# Altium schematic sheet MSXII_SteeringWheelBoard.SchDoc: Steering Wheel Right Board
size Letter; Organization: Midnight Sun Solar Rayce Car Team; Address1: University of Waterloo; Address2: 200 University Ave W; Address3: Waterloo, ON, Canada; Address4: N2L 3E9; Revision: 1.17; SheetNumber: 1; SheetTotal: 2; Website: www.uwmidsun.com
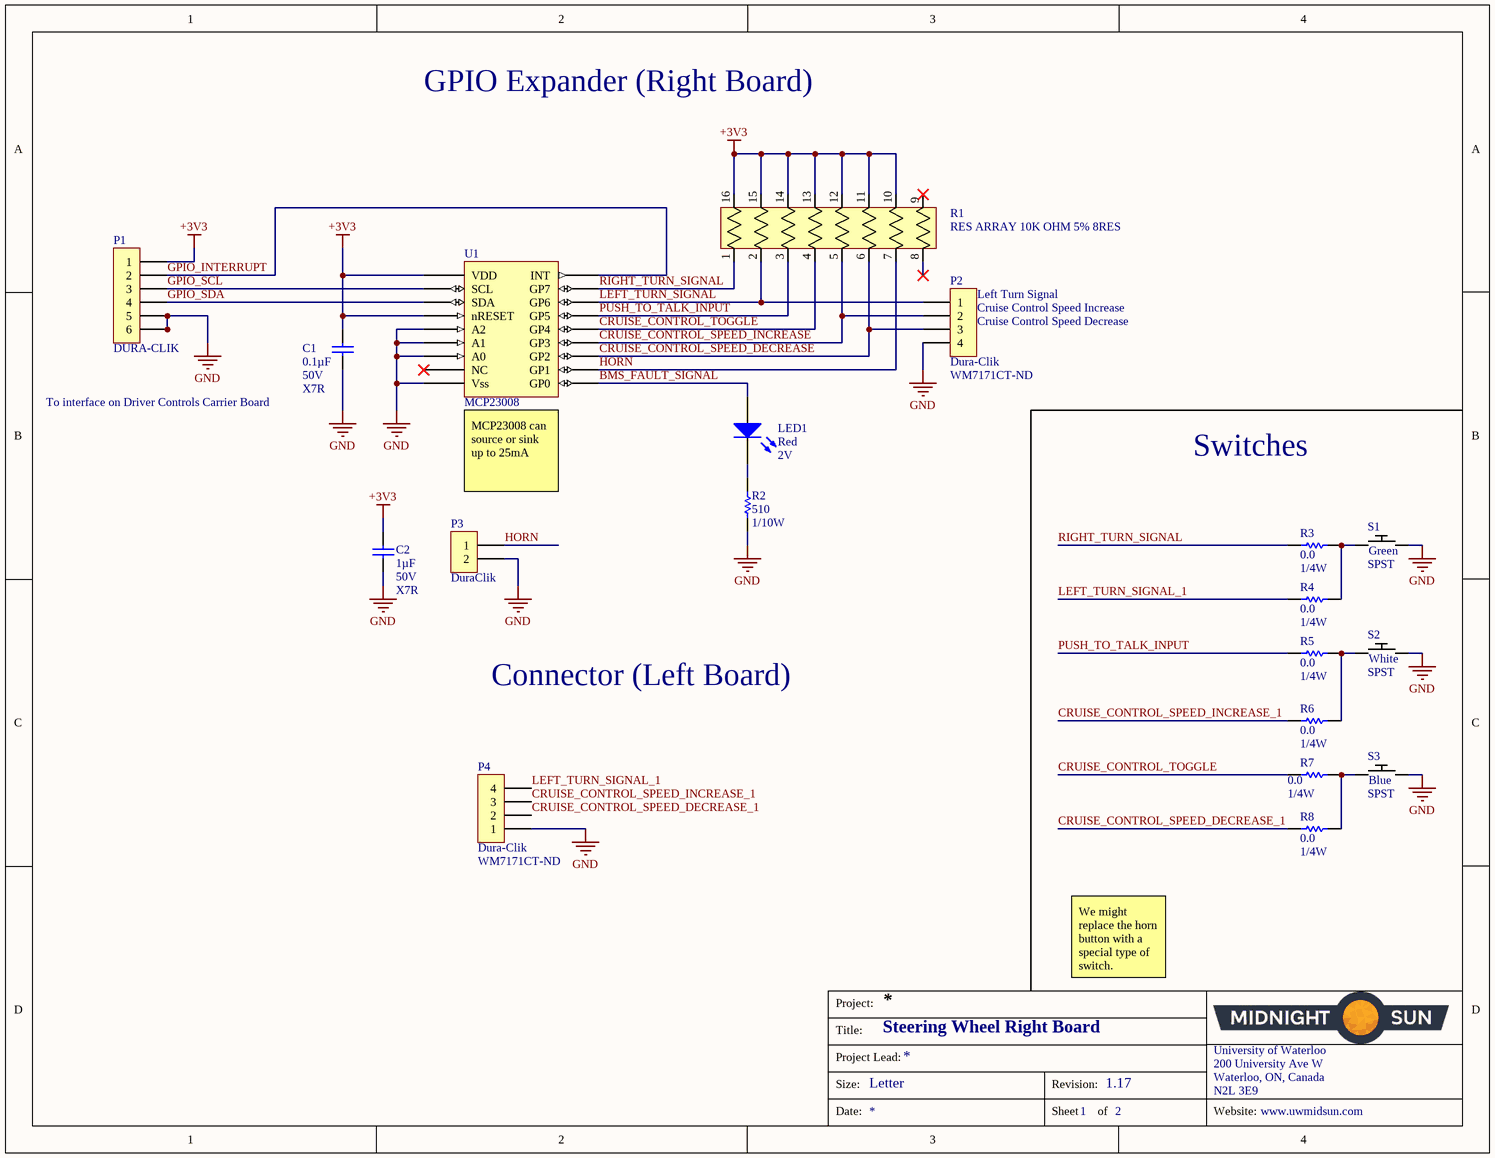
[diagram p0: MSXII_SteeringWheelBoard.SchDoc]

## Parts
C1  Capacitance: 0.1µF  Voltage: 50V  Temperature Coefficient: X7R  [CAP, 0603]  (hidden comment: CAP CER 0.1UF 50V 10% X7R 0603)
C2  Capacitance: 1µF  Voltage: 50V  Temperature Coefficient: X7R  [CAP, 0603]  (hidden comment: CAP CER 1UF 50V 10% X7R 0603)
LED1  Color: Red  Voltage - Forward (Vf) (Typ): 2V  [LED_0603]  (hidden comment: LED RED CLEAR 2V 0603)
P1  DURA-CLIK  [CONN, 6POS Dura-Click]
P2  Dura-Clik  Supplier Part Number 1: WM7171CT-ND  [CONN, 4POS Dura-Click]
P3  Series: DuraClik  [CONN, 2POS Dura-Click]  (hidden comment: CONN 2POS DURA-CLIK 0.079")
P4  Dura-Clik  Supplier Part Number 1: WM7171CT-ND  [CONN, 4POS Dura-Click]
R1  RES ARRAY 10K OHM 5% 8RES  [RES ARRAY, 8 POS 1506]
R2  Resistance: 510  Power: 1/10W  [RES, 0603]  (hidden comment: RES 510 OHM 5% 1/10W 0603)
R3  Resistance: 0.0  Power (Watts): 1/4W  [RES, 0603]  (hidden comment: RES 0.0 OHM 1/4W 0603)
R4  Resistance: 0.0  Power (Watts): 1/4W  [RES, 0603]  (hidden comment: RES 0.0 OHM 1/4W 0603)
R5  Resistance: 0.0  Power (Watts): 1/4W  [RES, 0603]  (hidden comment: RES 0.0 OHM 1/4W 0603)
R6  Resistance: 0.0  Power (Watts): 1/4W  [RES, 0603]  (hidden comment: RES 0.0 OHM 1/4W 0603)
R7  Resistance: 0.0  Power (Watts): 1/4W  [RES, 0603]  (hidden comment: RES 0.0 OHM 1/4W 0603)
R8  Resistance: 0.0  Power (Watts): 1/4W  [RES, 0603]  (hidden comment: RES 0.0 OHM 1/4W 0603)
S1  SPST  [SW SPST D6 SERIES GREEN]
S2  SPST  [SW SPST D6 SERIES WHITE]
S3  SPST  [SW SPST D6 SERIES BLUE]
U1  MCP23008  [IC 18SOIC]

## Nets
+3V3: C1.1 C2.1 P1.1 R1.10 R1.11 R1.12 R1.13 R1.14 R1.15 R1.16 U1.6(nRESET) U1.18(VDD)
GND: C1.2 C2.2 P1.5 P1.6 P2.4 P3.2 P4.1 R2.2 S1.2 S2.2 S3.2 U1.3(A2) U1.4(A1) U1.5(A0) U1.9(Vss)
BMS_FAULT_SIGNAL: LED1.1(A) U1.10(GP0)
CRUISE_CONTROL_SPEED_DECREASE: P2.3 R1.6 U1.12(GP2)
CRUISE_CONTROL_SPEED_DECREASE_1: P4.2 R8.1
CRUISE_CONTROL_SPEED_INCREASE: P2.2 R1.5 U1.13(GP3)
CRUISE_CONTROL_SPEED_INCREASE_1: P4.3 R6.1
CRUISE_CONTROL_TOGGLE: R1.4 R7.1 U1.14(GP4)
GPIO_INTERRUPT: P1.2 U1.8(INT)
GPIO_SCL: P1.3 U1.1(SCL)
GPIO_SDA: P1.4 U1.2(SDA)
HORN: P3.1 R1.7 U1.11(GP1)
LEFT_TURN_SIGNAL: P2.1 R1.2 U1.16(GP6)
LEFT_TURN_SIGNAL_1: P4.4 R4.1
PUSH_TO_TALK_INPUT: R1.3 R5.1 U1.15(GP5)
RIGHT_TURN_SIGNAL: R1.1 R3.1 U1.17(GP7)
NetLED1_2: LED1.2(K) R2.1
NetR3_2: R3.2 R4.2 S1.1
NetR5_2: R5.2 R6.2 S2.1
NetR7_2: R7.2 R8.2 S3.1

Not connected (* = marked no-connect by the designer): R1 8* 9*; U1 7(NC)*

## Notes on the sheet
- GPIO Expander (Right Board)
- (near P2) Left Turn Signal
- (near P2) Cruise Control Speed Increase
- (near P2) Cruise Control Speed Decrease
- To interface on Driver Controls Carrier Board
- (near U1) MCP23008 can source or sink up to 25mA
- Switches
- Connector (Left Board)
- We might replace the horn button with a special type of switch.
- Project:
- Title:
- Size:
- Project Lead:
- Letter
- Revision:
- University of Waterloo
- 200 University Ave W
- Waterloo, ON, Canada
- N2L 3E9
- Date:
- Sheet
- of
- Website:

## Library data of the parts
C1 = CAP CER 0.1UF 50V 10% X7R 0603: 0.10µF ±10% 50V Ceramic Capacitor X7R 0603 (1608 Metric); Manufacturer 1: AVX Corporation; Manufacturer Part Number 1: 06035C104KAT2A; Supplier 1: Digi-Key; Supplier Part Number 1: 478-5052-1-ND; Packaging: Cut Tape (CT); Part Status: Active; Operating Temperature: -55°C ~ 125°C; Ratings: -; Mounting Type: Surface Mount, MLCC; Package / Case: 0603 (1608 Metric); Size / Dimension: 0.063" L x 0.032" W (1.60mm x 0.81mm); Height - Seated (Max): -; Thickness (Max): 0.035" (0.90mm); Lead Spacing: -; Lead Style: -; ComponentLink1URL: http://datasheets.avx.com/X7RDielectric.pdf; ComponentLink1Description: http://datasheets.avx.com/X7RDielectric.pdf; Tolerance: ±10%
C2 = CAP CER 1UF 50V 10% X7R 0603: 1µF ±10% 50V Ceramic Capacitor X7R 0603 (1608 Metric); Manufacturer 1: Taiyo Yuden; Manufacturer Part Number 1: UMK107AB7105KA-T; Supplier 1: Digi-Key; Supplier Part Number 1: 587-3247-1-ND; Packaging: Cut Tape (CT); Part Status: Active; Operating Temperature: -55°C ~ 125°C; Ratings: -; Mounting Type: Surface Mount, MLCC; Package / Case: 0603 (1608 Metric); Size / Dimension: 0.063" L x 0.031" W (1.60mm x 0.80mm); Height - Seated (Max): -; Thickness (Max): 0.037" (0.95mm); Lead Spacing: -; Lead Style: -; ComponentLink1URL: http://www.yuden.co.jp/productdata/catalog/en/mlcc_all_e.pdf; ComponentLink1Description: http://www.yuden.co.jp/productdata/catalog/en/mlcc_all_e.pdf; Tolerance: ±10%
LED1 = LED RED CLEAR 2V 0603: Red 631nm LED Indication - Discrete 2V 0603 (1608 Metric); Manufacturer: Wurth Electronics Inc.; Manufacturer Part Number: 150060RS75000; Lens Color: Colorless; Millicandela Rating: 250mcd; Lens Style/Size: Rectangle with Flat Top, 1.10mm x 0.70mm; Current - Test: 20mA; Viewing Angle: 140°; Wavelength - Dominant: 625nm; Wavelength - Peak: 630nm; Supplier 1: Digi-Key; RoHS: RoHS Compliant; Category: Optoelectronics; Stock 1: 35521; Pricing 1: 1=0.21, 100=0.1617, 500=0.13964 (CAD); Packaging: Cut Tape (CT); Part Status: Active; Lens Transparency: Clear; Mounting Type: Surface Mount; Features: -; Package / Case: 0603 (1608 Metric); Supplier Device Package: 0603; Size / Dimension: 1.60mm L x 0.80mm W; Height (Max): 0.80mm; ComponentLink1URL: http://katalog.we-online.de/led/datasheet/150060RS75000.pdf; ComponentLink1Description: http://katalog.we-online.de/led/datasheet/150060RS75000.pdf; Supplier Part Number 1: 732-4978-1-ND
P1 = CONN 6POS DURA-CLIK 0.079" RGT: 6 Positions Header, Shrouded Connector 0.079" (2.00mm) Surface Mount, Right Angle Tin; Manufacturer: Molex, LLC; Manufacturer Part Number: 5023520600; Style: Board to Cable/Wire; Shrouding: Shrouded - 4 Wall; Number of Positions: 6; Number of Positions Loaded: All; Contact Length - Mating: 0.135" (3.45mm); Material Flammability Rating: UL94 V-0; Mated Stacking Heights: 11mm; Supplier 1: Digi-Key; RoHS: RoHS Compliant; Category: Connectors, Interconnects; Stock 1: 3108; Pricing 1: 1=2.31, 10=2.091, 25=1.964, 50=1.8784, 100=1.7929, 250=1.6222 (CAD); Packaging: Cut Tape (CT); Part Status: Active; Connector Type: Header; Contact Type: Male Pin; Pitch - Mating: 0.079" (2.00mm); Number of Rows: 1; Row Spacing - Mating: -; Mounting Type: Surface Mount, Right Angle; Termination: Solder; Fastening Type: Latch Lock; Contact Length - Post: -; Overall Contact Length: -; Insulation Height: 0.252" (6.40mm); Contact Shape: Square; Contact Finish - Mating: Tin; Contact Finish Thickness - Mating: -; Contact Finish - Post: Tin; Contact Material: Copper Alloy; Insulation Material: Polyamide (PA), Nylon; Features: Solder Retention; Operating Temperature: -; Ingress Protection: -; Insulation Color: Natural; Current Rating: -; Voltage Rating: -; Contact Finish Thickness - Post: -; Applications: Automotive, Industrial; ComponentLink1URL: http://www.molex.com/pdm_docs/sd/5023520200_sd.pdf; ComponentLink1Description: http://www.molex.com/pdm_docs/sd/5023520200_sd.pdf; Supplier Part Number 1: WM7173CT-ND
P2 P4 = CONN 4POS DURA-CLIK 0.079" RGT: 4 Positions Header Connector 0.079" (2.00mm) Surface Mount, Right Angle Tin; Manufacturer: Molex, LLC; Manufacturer Part Number: 5023520400; Style: Board to Cable/Wire; Shrouding: Shrouded - 4 Wall; Number of Positions: 4; Number of Positions Loaded: All; Contact Length - Mating: 0.135" (3.45mm); Material Flammability Rating: UL94 V-0; Mated Stacking Heights: 11mm; Supplier 1: Digi-Key; RoHS: RoHS Compliant; Category: Connectors, Interconnects; Stock 1: 10075; Pricing 1: 1=2.07, 10=1.823, 25=1.7164, 50=1.6446, 100=1.5731, 250=1.43016 (CAD); Packaging: Cut Tape (CT); Part Status: Active; Connector Type: Header; Contact Type: Male Pin; Pitch - Mating: 0.079" (2.00mm); Number of Rows: 1; Row Spacing - Mating: -; Mounting Type: Surface Mount, Right Angle; Termination: Solder; Fastening Type: Latch Lock; Contact Length - Post: -; Overall Contact Length: -; Insulation Height: 0.252" (6.40mm); Contact Shape: Square; Contact Finish - Mating: Tin; Contact Finish Thickness - Mating: -; Contact Finish - Post: Tin; Contact Material: Copper Alloy; Insulation Material: Polyamide (PA), Nylon; Features: Solder Retention; Operating Temperature: -; Ingress Protection: -; Insulation Color: Natural; Current Rating: -; Voltage Rating: -; Contact Finish Thickness - Post: -; Applications: Automotive, Industrial; ComponentLink1URL: http://www.molex.com/pdm_docs/sd/5023520200_sd.pdf; ComponentLink1Description: http://www.molex.com/pdm_docs/sd/5023520200_sd.pdf
P3 = CONN 2POS DURA-CLIK 0.079": 2 Positions Header, Shrouded Connector 0.079" (2.00mm) Surface Mount, Right Angle Tin; Manufacturer 1: Molex, LLC; Manufacturer Part Number 1: 5023520200; Style: Board to Cable/Wire; Shrouding: Shrouded - 4 Wall; Number of Positions: 2; Number of Positions Loaded: All; Contact Length - Mating: 0.135" (3.45mm); Material Flammability Rating: UL94 V-0; Mated Stacking Heights: 11mm; Supplier 1: Digi-Key; Supplier Part Number 1: WM7169CT-ND; Packaging: Cut Tape (CT); Part Status: Active; Connector Type: Header; Contact Type: Male Pin; Number of Rows: 1; Row Spacing - Mating: -; Mounting Type: Surface Mount, Right Angle; Termination: Solder; Fastening Type: Latch Lock; Contact Length - Post: -; Overall Contact Length: -; Insulation Height: 0.252" (6.40mm); Contact Shape: Square; Contact Finish - Mating: Tin; Contact Finish Thickness - Mating: -; Contact Finish - Post: Tin; Contact Material: Copper Alloy; Insulation Material: Polyamide (PA), Nylon; Operating Temperature: -; Ingress Protection: -; Insulation Color: Natural; Current Rating: -; Contact Finish Thickness - Post: -; ComponentLink1URL: http://www.molex.com/pdm_docs/sd/5023520200_sd.pdf; ComponentLink1Description: http://www.molex.com/pdm_docs/sd/5023520200_sd.pdf; Voltage: -; Pitch - Mating: 0.079" (2.00mm)
R1 = RES ARRAY 10K OHM 5% 8RES EXB-2HV103JV: RES ARRAY SMD 10K 5% 62.5mW 1506; Manufacturer: Panasonic Electronic Components; Vendor: Panasonic; C: Copyright (C) 2015 Accelerated Designs. All rights reserved; Circuit Type: Isolated; Temperature Coefficient: ±200ppm/°C; Value: Value; Copyright: Copyright (C) 2015 Accelerated Designs. All rights reserved; Manufacturer_Part_Number: EXB-2HV103JV; Supplier 1: Digi-Key; Supplier Part Number 1: Y1103CT-ND; Manufacturer Part Number: EXB-2HV103JV; RoHS: RoHS Compliant; Category: Resistors; Stock 1: 152779; Pricing 1: 1=0.43, 10=0.373, 25=0.2712, 50=0.1964, 100=0.1456, 250=0.11176, 500=0.08806, 1000=0.06096 (CAD); Packaging: Cut Tape (CT); Part Status: Active; Resistance (Ohms): 10k; Tolerance: ±5%; Power Per Element: 62.5mW; Operating Temperature: -55°C ~ 125°C; Applications: Automotive AEC-Q200; Mounting Type: Surface Mount; Package / Case: 1506, Convex, Long Side Terminals; Supplier Device Package: 1506; Size / Dimension: 0.150" L x 0.063" W (3.80mm x 1.60mm); Height - Seated (Max): 0.022" (0.55mm); ComponentLink1URL: https://industrial.panasonic.com/cdbs/www-data/pdf/AOC0000/AOC0000C14.pdf; ComponentLink1Description: https://industrial.panasonic.com/cdbs/www-data/pdf/AOC0000/AOC0000C14.pdf
R2 = RES 510 OHM 5% 1/10W 0603: RES SMD 510 OHM 5% 1/10W 0603; Manufacturer 1: Yageo; Manufacturer Part Number 1: RC0603JR-07510RL; Temperature Coefficient: ±100ppm/°C; Supplier 1: Digi-Key; Supplier Part Number 1: 311-510GRCT-ND; Packaging: Cut Tape (CT); Part Status: Active; Composition: Thick Film; Operating Temperature: -55°C ~ 155°C; Package / Case: 0603 (1608 Metric); Supplier Device Package: 0603; Size / Dimension: 0.063" L x 0.031" W (1.60mm x 0.80mm); Height - Seated (Max): 0.022" (0.55mm); Failure Rate: -; ComponentLink1URL: http://www.yageo.com/documents/recent/PYu-RC_Group_51_RoHS_L_7.pdf; ComponentLink1Description: http://www.yageo.com/documents/recent/PYu-RC_Group_51_RoHS_L_7.pdf; Tolerance: ±5%
R3-R8 = RES 0.0 OHM 1/4W 0603: RES SMD 0.0 OHM JUMPER 1/4W 0603; Manufacturer 1: Vishay Dale; Manufacturer Part Number 1: CRCW06030000Z0EAHP; Supplier 1: Digi-Key; Supplier Part Number 1: 541-0.0SBCT-ND; Packaging: Cut Tape (CT); Part Status: Active; Composition: Thick Film; Operating Temperature: -55°C ~ 155°C; Package / Case: 0603 (1608 Metric); Supplier Device Package: 0603; Size / Dimension: 0.063" L x 0.033" W (1.60mm x 0.85mm); Height - Seated (Max): 0.022" (0.55mm); Failure Rate: -; ComponentLink1URL: http://www.vishay.com/docs/20043/crcwhpe3.pdf; ComponentLink1Description: http://www.vishay.com/docs/20043/crcwhpe3.pdf
S1 = SW SPST-NO 0.1A 32V D6 Series Green: Pushbutton Switch SPST-NO Keyswitch Through Hole D6 Series Green; Manufacturer: C&K; Manufacturer Part Number: D6R50 F1 LFS; Switch Function: Off-Mom; Current Rating: 100mA (DC); Voltage Rating - DC: 32V; Actuator Type: Round, Button; Electrical Life: 250,000 Cycles; Supplier 1: Digi-Key; RoHS: RoHS Compliant; Category: Switches; Stock 1: 3742; Pricing 1: 1=1.73, 10=1.607, 25=1.5308, 50=1.454, 100=1.4158, 250=1.37756, 500=1.30102, 1000=1.22448, 5000=1.03316 (CAD); Packaging: Bulk; Part Status: Active; Type: Keyswitch; Circuit: SPST-NO; Voltage Rating - AC: -; Color - Actuator/Cap: Green; Illumination Type, Color: -; Illumination Voltage (Nominal): -; Mounting Type: Through Hole; Termination Style: PC Pin; Ingress Protection: -; Features: Tactile Feedback; Panel Cutout Dimensions: -; Operating Temperature: -20°C ~ 85°C; Mechanical Life: -; ComponentLink1URL: http://www.ckswitches.com/media/1341/d6.pdf; ComponentLink1Description: http://www.ckswitches.com/media/1341/d6.pdf; Supplier Part Number 1: 401-1976-ND
S2 = SW SPST-NO 0.1A 32V D6 Series White: Pushbutton Switch SPST-NO Keyswitch Through Hole D6 Series White; Manufacturer: C&K; Manufacturer Part Number: D6R00 F2 LFS; Switch Function: Off-Mom; Current Rating: 100mA (DC); Voltage Rating - DC: 32V; Actuator Type: Round, Button; Electrical Life: 250,000 Cycles; Supplier 1: Digi-Key; RoHS: RoHS Compliant; Category: Switches; Stock 1: 6244; Pricing 1: 1=1.64, 10=1.532, 25=1.4584, 50=1.3856, 100=1.3492, 250=1.31272, 500=1.2398, 1000=1.16686, 5000=0.98454 (CAD); Packaging: Bulk; Part Status: Active; Type: Keyswitch; Circuit: SPST-NO; Voltage Rating - AC: -; Color - Actuator/Cap: White; Illumination Type, Color: -; Illumination Voltage (Nominal): -; Mounting Type: Through Hole; Termination Style: PC Pin; Ingress Protection: -; Features: Tactile Feedback; Panel Cutout Dimensions: -; Operating Temperature: -20°C ~ 85°C; Mechanical Life: -; ComponentLink1URL: http://www.ckswitches.com/media/1341/d6.pdf; ComponentLink1Description: http://www.ckswitches.com/media/1341/d6.pdf; Supplier Part Number 1: 401-1989-ND; Supplier 2: Digi-Key; Stock 2: 3742; Pricing 2: 1=1.73, 10=1.607, 25=1.5308, 50=1.454, 100=1.4158, 250=1.37756, 500=1.30102, 1000=1.22448, 5000=1.03316 (CAD); Supplier Part Number 2: 401-1976-ND
S3 = SW SPST-NO 0.1A 32V D6 Series Blue: Pushbutton Switch SPST-NO Keyswitch Through Hole D6 Series Blue; Manufacturer: C&K; Manufacturer Part Number: D6R60 F1 LFS; Switch Function: Off-Mom; Current Rating: 100mA (DC); Voltage Rating - DC: 32V; Actuator Type: Round, Button; Electrical Life: 250,000 Cycles; Supplier 1: Digi-Key; RoHS: RoHS Compliant; Category: Switches; Stock 1: 3385; Pricing 1: 1=1.73, 10=1.607, 25=1.5308, 50=1.454, 100=1.4158, 250=1.37756, 500=1.30102, 1000=1.22448, 5000=1.03316 (CAD); Packaging: Bulk; Part Status: Active; Type: Keyswitch; Circuit: SPST-NO; Voltage Rating - AC: -; Color - Actuator/Cap: Blue; Illumination Type, Color: -; Illumination Voltage (Nominal): -; Mounting Type: Through Hole; Termination Style: PC Pin; Ingress Protection: -; Features: Tactile Feedback; Panel Cutout Dimensions: -; Operating Temperature: -20°C ~ 85°C; Mechanical Life: -; ComponentLink1URL: http://www.ckswitches.com/media/1341/d6.pdf; ComponentLink1Description: http://www.ckswitches.com/media/1341/d6.pdf; Supplier Part Number 1: 401-1977-ND
U1 = IC I/O EXPANDER I2C 8B 18SOIC: MCP23008 I/O Expander 8B+1Int 18P SOIC; Manufacturer: Microchip Technology; Manufacturer Part Number: MCP23008T-E/SO; Number of I/O: 8; Interface: I²C; Interrupt Output: Yes; Output Type: Push-Pull; Current - Output Source/Sink: 25mA; Voltage - Supply: 1.8 V ~ 5.5 V; Supplier 1: Digi-Key; Supplier Part Number 1: MCP23008T-E/SOCT-ND; RoHS: RoHS Compliant; Category: Integrated Circuits (ICs); Stock 1: 5607; Pricing 1: 1=1.62, 25=1.3548, 100=1.2431 (CAD); Packaging: Cut Tape (CT); Part Status: Active; Features: POR; Operating Temperature: -40°C ~ 125°C; Mounting Type: Surface Mount; Package / Case: 18-SOIC (0.295", 7.50mm Width); Supplier Device Package: 18-SOIC; ComponentLink1URL: http://www.microchip.com/mymicrochip/filehandler.aspx?ddocname=en021920; ComponentLink1Description: http://www.microchip.com/mymicrochip/filehandler.aspx?ddocname=en021920